# Altium schematic sheet Switch.SchDoc
size A0
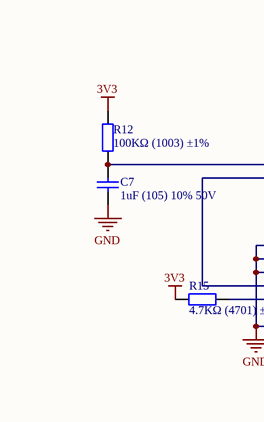
[diagram p0: Switch.SchDoc, top left]
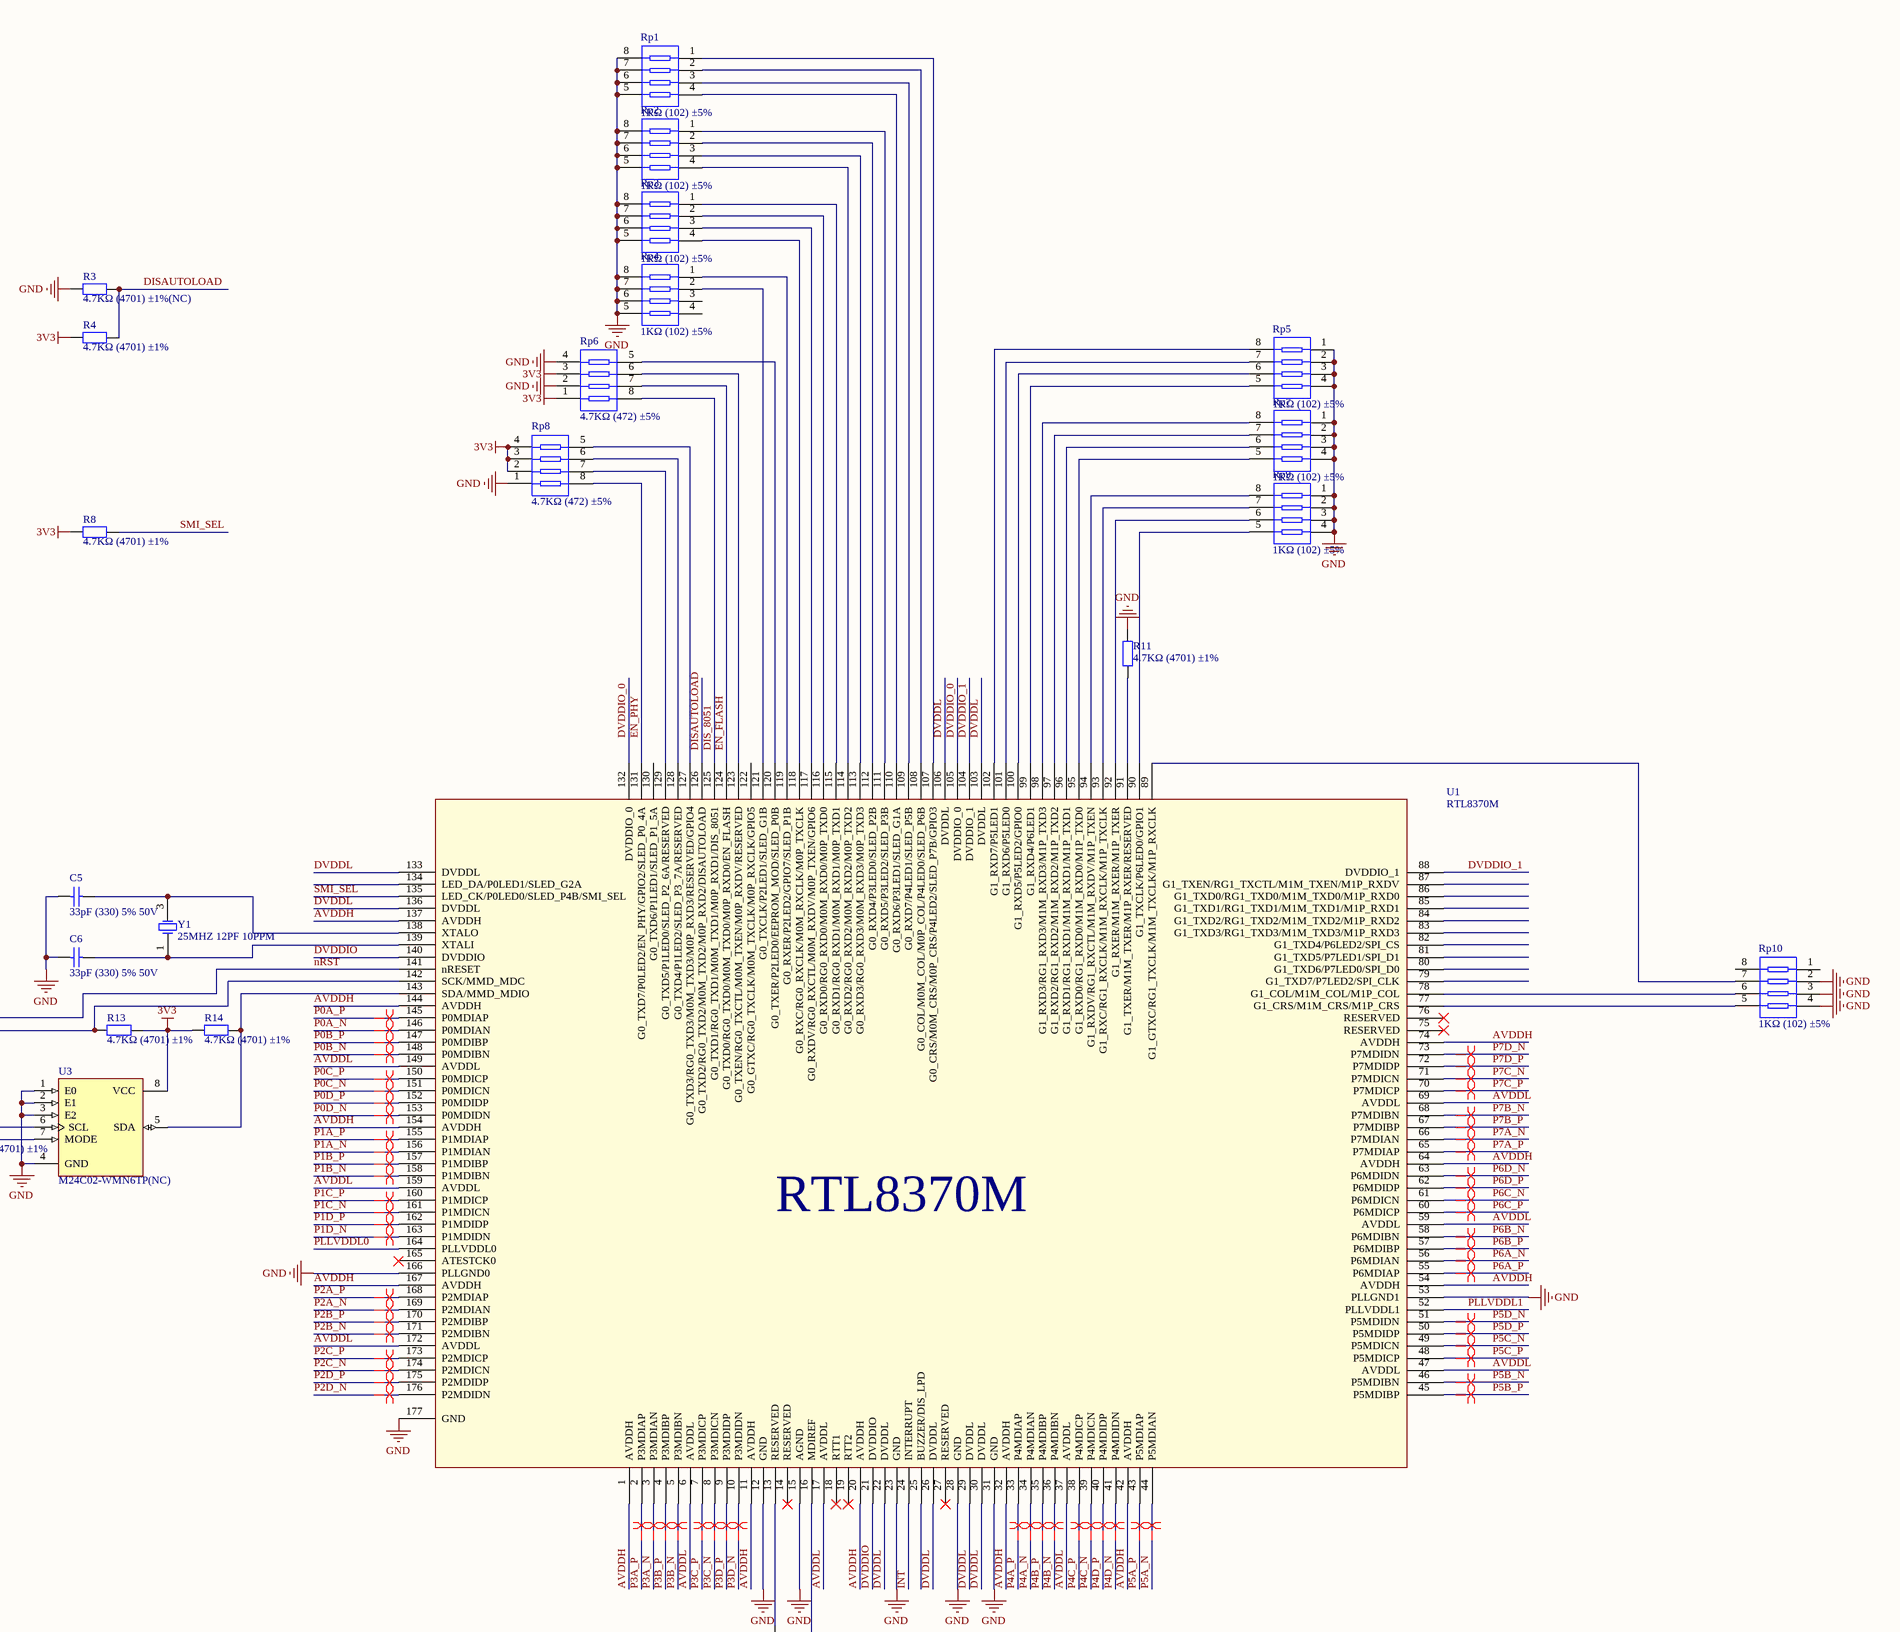
[diagram p1: Switch.SchDoc, top right]
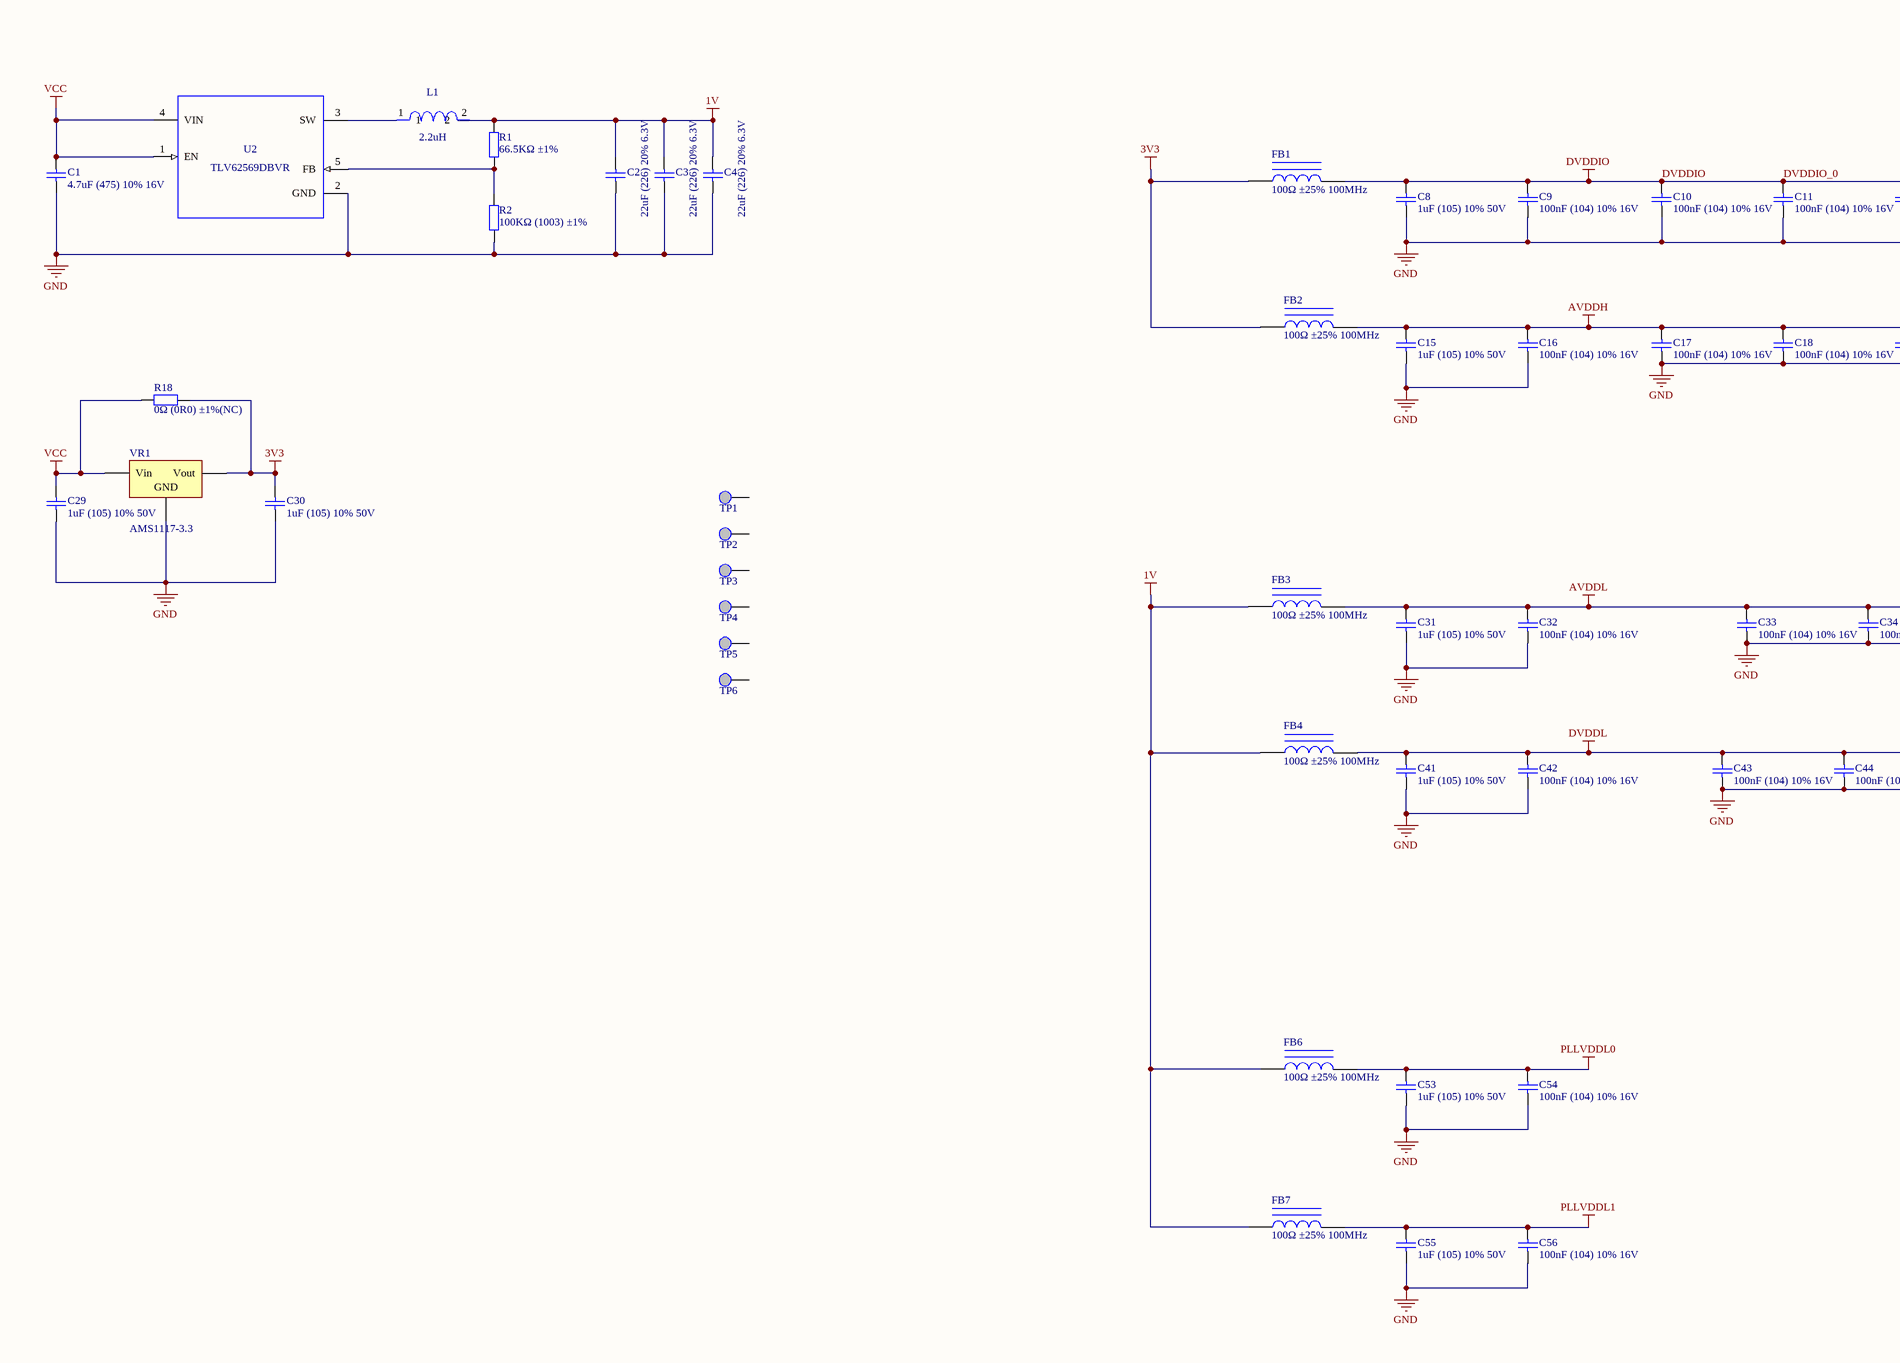
[diagram p2: Switch.SchDoc, bottom left]
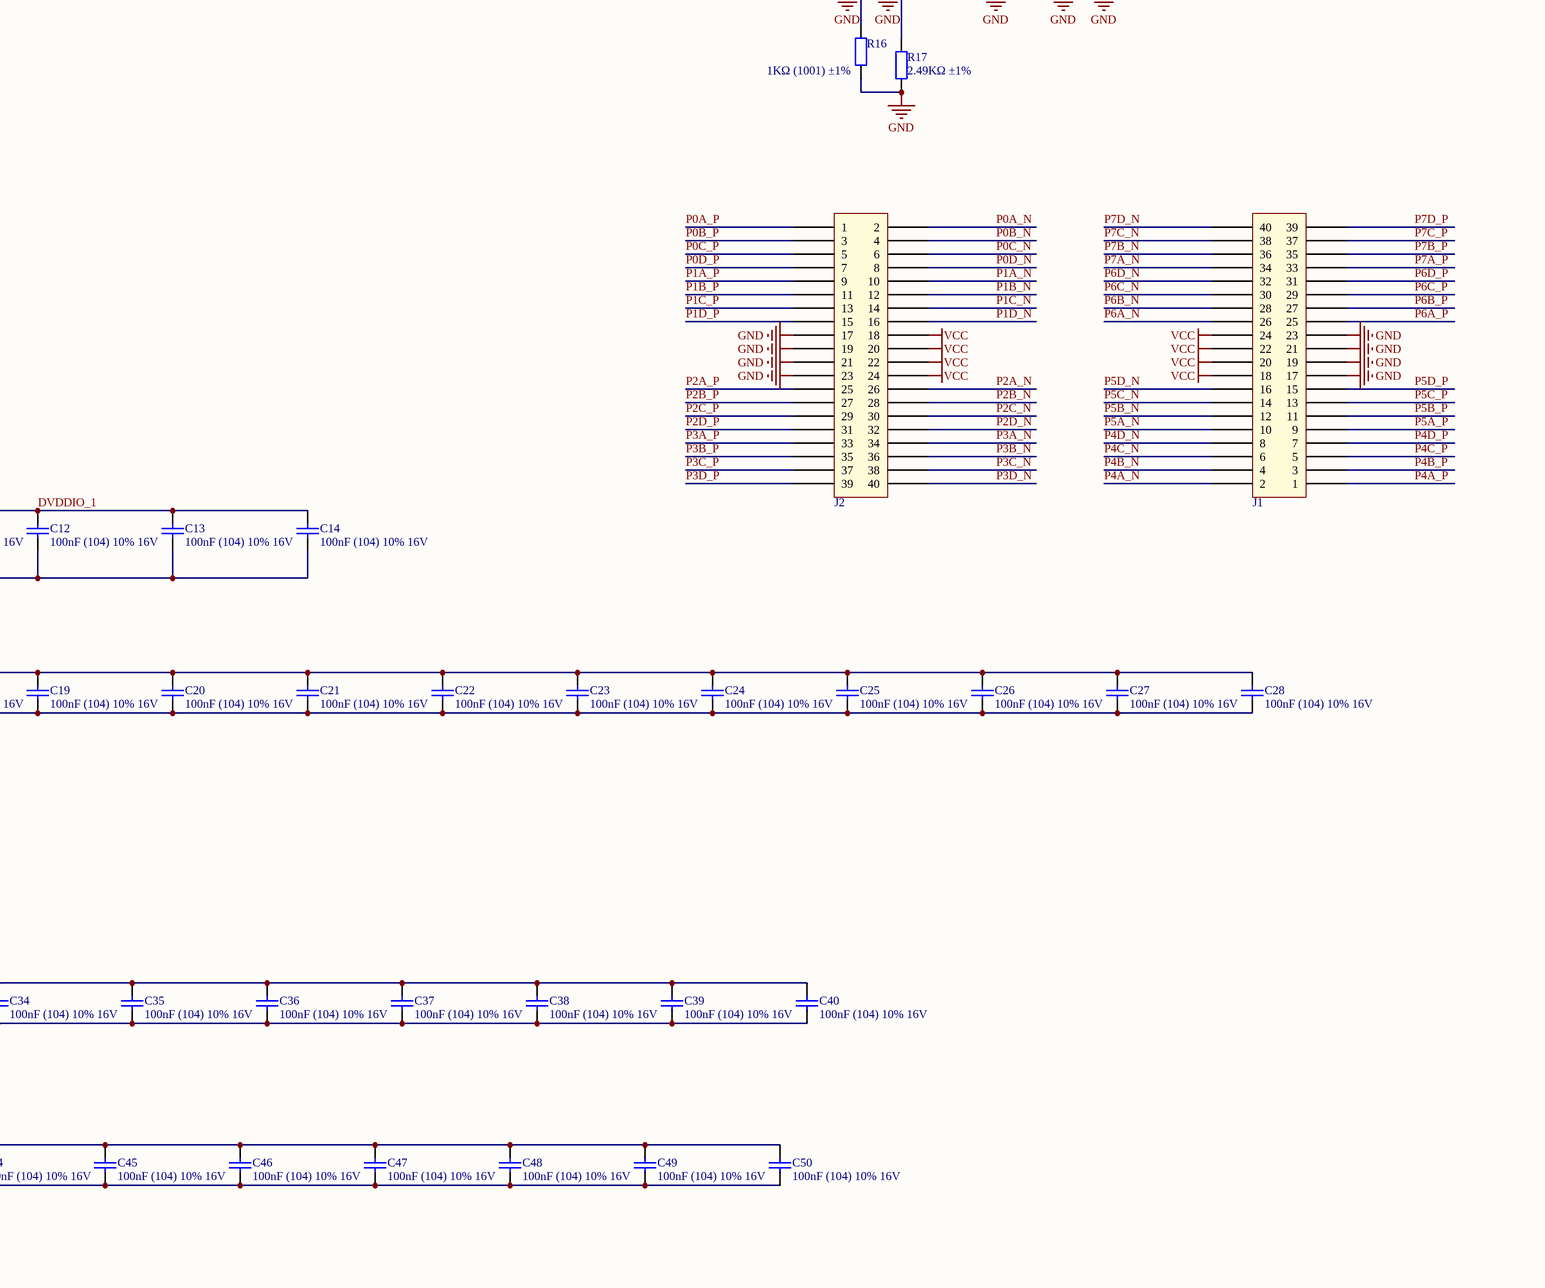
[diagram p3: Switch.SchDoc, bottom right]

## Parts
C1  4.7uF (475) 10% 16V  [0603_C]
C2  22uF (226) 20% 6.3V  [0603_C]
C3  22uF (226) 20% 6.3V  [0603_C]
C4  22uF (226) 20% 6.3V  [0603_C]
C5  33pF (330) 5% 50V  [0402_C]
C6  33pF (330) 5% 50V  [0402_C]
C7  1uF (105) 10% 50V  [0603_C]
C8  1uF (105) 10% 50V  [0603_C]
C9  100nF (104) 10% 16V  [0402_C]
C10  100nF (104) 10% 16V  [0402_C]
C11  100nF (104) 10% 16V  [0402_C]
C12  100nF (104) 10% 16V  [0402_C]
C13  100nF (104) 10% 16V  [0402_C]
C14  100nF (104) 10% 16V  [0402_C]
C15  1uF (105) 10% 50V  [0603_C]
C16  100nF (104) 10% 16V  [0402_C]
C17  100nF (104) 10% 16V  [0402_C]
C18  100nF (104) 10% 16V  [0402_C]
C19  100nF (104) 10% 16V  [0402_C]
C20  100nF (104) 10% 16V  [0402_C]
C21  100nF (104) 10% 16V  [0402_C]
C22  100nF (104) 10% 16V  [0402_C]
C23  100nF (104) 10% 16V  [0402_C]
C24  100nF (104) 10% 16V  [0402_C]
C25  100nF (104) 10% 16V  [0402_C]
C26  100nF (104) 10% 16V  [0402_C]
C27  100nF (104) 10% 16V  [0402_C]
C28  100nF (104) 10% 16V  [0402_C]
C29  1uF (105) 10% 50V  [0603_C]
C30  1uF (105) 10% 50V  [0603_C]
C31  1uF (105) 10% 50V  [0603_C]
C32  100nF (104) 10% 16V  [0402_C]
C33  100nF (104) 10% 16V  [0402_C]
C34  100nF (104) 10% 16V  [0402_C]
C35  100nF (104) 10% 16V  [0402_C]
C36  100nF (104) 10% 16V  [0402_C]
C37  100nF (104) 10% 16V  [0402_C]
C38  100nF (104) 10% 16V  [0402_C]
C39  100nF (104) 10% 16V  [0402_C]
C40  100nF (104) 10% 16V  [0402_C]
C41  1uF (105) 10% 50V  [0603_C]
C42  100nF (104) 10% 16V  [0402_C]
C43  100nF (104) 10% 16V  [0402_C]
C44  100nF (104) 10% 16V  [0402_C]
C45  100nF (104) 10% 16V  [0402_C]
C46  100nF (104) 10% 16V  [0402_C]
C47  100nF (104) 10% 16V  [0402_C]
C48  100nF (104) 10% 16V  [0402_C]
C49  100nF (104) 10% 16V  [0402_C]
C50  100nF (104) 10% 16V  [0402_C]
C53  1uF (105) 10% 50V  [0603_C]
C54  100nF (104) 10% 16V  [0402_C]
C55  1uF (105) 10% 50V  [0603_C]
C56  100nF (104) 10% 16V  [0402_C]
FB1  100Ω ±25% 100MHz  [0805_L]
FB2  100Ω ±25% 100MHz  [0805_L]
FB3  100Ω ±25% 100MHz  [0805_L]
FB4  100Ω ±25% 100MHz  [0805_L]
FB6  100Ω ±25% 100MHz  [0805_L]
FB7  100Ω ±25% 100MHz  [0805_L]
J1  Header20x2_2.54_female  [2-534206-0]  (value not drawn)
J2  Header20x2_2.54_female  [2-534206-0]  (value not drawn)
L1  value 2.2uH  [XAL4020]  (hidden comment: XAL4020-222MEB)
R1  66.5KΩ ±1%  [0603_R]
R2  100KΩ (1003) ±1%  [0603_R]
R3  4.7KΩ (4701) ±1%(NC)  [0402_R]
R4  4.7KΩ (4701) ±1%  [0402_R]
R8  4.7KΩ (4701) ±1%  [0402_R]
R11  4.7KΩ (4701) ±1%  [0402_R]
R12  100KΩ (1003) ±1%  [0402_R]
R13  4.7KΩ (4701) ±1%  [0402_R]
R14  4.7KΩ (4701) ±1%  [0402_R]
R15  4.7KΩ (4701) ±1%  [0402_R]
R16  1KΩ (1001) ±1%  [0402_R]
R17  2.49KΩ ±1%  [0402_R]
R18  0Ω (0R0) ±1%(NC)  [1206_R]
Rp1  1KΩ (102) ±5%  [0402_Rx4]
Rp2  1KΩ (102) ±5%  [0402_Rx4]
Rp3  1KΩ (102) ±5%  [0402_Rx4]
Rp4  1KΩ (102) ±5%  [0402_Rx4]
Rp5  1KΩ (102) ±5%  [0402_Rx4]
Rp6  4.7KΩ (472) ±5%  [0603_Rx4]
Rp7  1KΩ (102) ±5%  [0402_Rx4]
Rp8  4.7KΩ (472) ±5%  [0603_Rx4]
Rp9  1KΩ (102) ±5%  [0402_Rx4]
Rp10  1KΩ (102) ±5%  [0402_Rx4]
TP1  Test Point, 30mil  [test_point_30_mil]  (value not drawn)
TP2  Test Point, 30mil  [test_point_30_mil]  (value not drawn)
TP3  Test Point, 30mil  [test_point_30_mil]  (value not drawn)
TP4  Test Point, 30mil  [test_point_30_mil]  (value not drawn)
TP5  Test Point, 30mil  [test_point_30_mil]  (value not drawn)
TP6  Test Point, 30mil  [test_point_30_mil]  (value not drawn)
U1  RTL8370M  [PLQP0176LA-B-M]
U2  TLV62569DBVR  [DBV0005A_M]
U3  M24C02-WMN6TP(NC)  [SOIC-8_150mil]
VR1  AMS1117-3.3  [SOT-223]
Y1  25MHZ 12PF 10PPM  [SMD-3225_4P]

## Nets
1V: C2.2 C3.2 C4.2 FB3.1 FB4.1 FB6.1 FB7.1 L1.2 R1.2
3V3: C30.2 FB1.1 FB2.1 R4.1 R8.1 R12.2 R13.2 R14.1 R15.1 R18.2 Rp6.1 Rp6.3 Rp8.2 Rp8.3 Rp8.4 U3.8(VCC) VR1.2(Vout)
AVDDH: C15.2 C16.2 C17.2 C18.2 C19.2 C20.2 C21.2 C22.2 C23.2 C24.2 C25.2 C26.2 C27.2 C28.2 FB2.2 U1.1(AVDDH) U1.11(AVDDH) U1.20(AVDDH) U1.32(AVDDH) U1.42(AVDDH) U1.54(AVDDH) U1.64(AVDDH) U1.74(AVDDH) U1.137(AVDDH) U1.144(AVDDH) U1.154(AVDDH) U1.167(AVDDH)
AVDDL: C31.2 C32.2 C33.2 C34.2 C35.2 C36.2 C37.2 C38.2 C39.2 C40.2 FB3.2 U1.6(AVDDL) U1.17(AVDDL) U1.37(AVDDL) U1.47(AVDDL) U1.59(AVDDL) U1.69(AVDDL) U1.149(AVDDL) U1.159(AVDDL) U1.172(AVDDL)
DVDDIO: C8.2 C9.2 C10.2 C11.2 C12.2 C13.2 C14.2 FB1.2 U1.21(DVDDIO) U1.88(DVDDIO_1) U1.104(DVDDIO_1) U1.105(DVDDIO_0) U1.132(DVDDIO_0) U1.140(DVDDIO)  [also labelled DVDDIO_0, DVDDIO_1]
DVDDL: C41.2 C42.2 C43.2 C44.2 C45.2 C46.2 C47.2 C48.2 C49.2 C50.2 FB4.2 U1.22(DVDDL) U1.26(DVDDL) U1.29(DVDDL) U1.30(DVDDL) U1.103(DVDDL) U1.106(DVDDL) U1.133(DVDDL) U1.136(DVDDL)
GND: C1.1 C2.1 C3.1 C4.1 C5.1 C6.1 C7.1 C8.1 C9.1 C10.1 C11.1 C12.1 C13.1 C14.1 C15.1 C16.1 C17.1 C18.1 C19.1 C20.1 C21.1 C22.1 C23.1 C24.1 C25.1 C26.1 C27.1 C28.1 C29.1 C30.1 C31.1 C32.1 C33.1 C34.1 C35.1 C36.1 C37.1 C38.1 C39.1 C40.1 C41.1 C42.1 C43.1 C44.1 C45.1 C46.1 C47.1 C48.1 C49.1 C50.1 C53.1 C54.1 C55.1 C56.1 J1.17 J1.19 J1.21 J1.23 J2.17 J2.19 J2.21 J2.23 R2.1 R3.1 R11.1 R16.1 R17.1 Rp1.5 Rp1.6 Rp1.7 Rp1.8 Rp2.5 Rp2.6 Rp2.7 Rp2.8 Rp3.5 Rp3.6 Rp3.7 Rp3.8 Rp4.5 Rp4.6 Rp4.7 Rp4.8 Rp5.1 Rp5.2 Rp5.3 Rp5.4 Rp6.2 Rp6.4 Rp7.1 Rp7.2 Rp7.3 Rp7.4 Rp8.1 Rp9.1 Rp9.2 Rp9.3 Rp9.4 Rp10.2 Rp10.3 Rp10.4 U1.12(GND) U1.15(AGND) U1.23(GND) U1.28(GND) U1.31(GND) U1.53(PLLGND1) U1.166(PLLGND0) U1.177(GND) U2.2(GND) U3.1(E0) U3.2(E1) U3.3(E2) U3.4(GND) VR1.1(GND)
PLLVDDL0: C53.2 C54.2 FB6.2 U1.164(PLLVDDL0)
PLLVDDL1: C55.2 C56.2 FB7.2 U1.52(PLLVDDL1)
VCC: C1.2 C29.2 J1.18 J1.20 J1.22 J1.24 J2.18 J2.20 J2.22 J2.24 R18.1 U2.1(EN) U2.4(VIN) VR1.3(Vin)
DIS_8051: Rp6.8 U1.125(G0_TXD1/RG0_TXD1/M0M_TXD1/M0P_RXD1/DIS_8051)
DISAUTOLOAD: R3.2 R4.2 U1.126(G0_TXD2/RG0_TXD2/M0M_TXD2/M0P_RXD2/DISAUTOLOAD)
EN_FLASH: Rp6.7 U1.124(G0_TXD0/RG0_TXD0/M0M_TXD0/M0P_RXD0/EN_FLASH)
EN_PHY: Rp8.8 U1.131(G0_TXD7/P0LED2/EN_PHY/GPIO2/SLED_P0_4A)
INT: U1.24(INTERRUPT)
nRST: C7.2 R12.1 U1.141(nRESET)
P0A_N: J2.2 U1.146(P0MDIAN)
P0A_P: J2.1 U1.145(P0MDIAP)
P0B_N: J2.4 U1.148(P0MDIBN)
P0B_P: J2.3 U1.147(P0MDIBP)
P0C_N: J2.6 U1.151(P0MDICN)
P0C_P: J2.5 U1.150(P0MDICP)
P0D_N: J2.8 U1.153(P0MDIDN)
P0D_P: J2.7 U1.152(P0MDIDP)
P1A_N: J2.10 U1.156(P1MDIAN)
P1A_P: J2.9 U1.155(P1MDIAP)
P1B_N: J2.12 U1.158(P1MDIBN)
P1B_P: J2.11 U1.157(P1MDIBP)
P1C_N: J2.14 U1.161(P1MDICN)
P1C_P: J2.13 U1.160(P1MDICP)
P1D_N: J2.16 U1.163(P1MDIDN)
P1D_P: J2.15 U1.162(P1MDIDP)
P2A_N: J2.26 U1.169(P2MDIAN)
P2A_P: J2.25 U1.168(P2MDIAP)
P2B_N: J2.28 U1.171(P2MDIBN)
P2B_P: J2.27 U1.170(P2MDIBP)
P2C_N: J2.30 U1.174(P2MDICN)
P2C_P: J2.29 U1.173(P2MDICP)
P2D_N: J2.32 U1.176(P2MDIDN)
P2D_P: J2.31 U1.175(P2MDIDP)
P3A_N: J2.34 U1.3(P3MDIAN)
P3A_P: J2.33 U1.2(P3MDIAP)
P3B_N: J2.36 U1.5(P3MDIBN)
P3B_P: J2.35 U1.4(P3MDIBP)
P3C_N: J2.38 U1.8(P3MDICN)
P3C_P: J2.37 U1.7(P3MDICP)
P3D_N: J2.40 U1.10(P3MDIDN)
P3D_P: J2.39 U1.9(P3MDIDP)
P4A_N: J1.2 U1.34(P4MDIAN)
P4A_P: J1.1 U1.33(P4MDIAP)
P4B_N: J1.4 U1.36(P4MDIBN)
P4B_P: J1.3 U1.35(P4MDIBP)
P4C_N: J1.6 U1.39(P4MDICN)
P4C_P: J1.5 U1.38(P4MDICP)
P4D_N: J1.8 U1.41(P4MDIDN)
P4D_P: J1.7 U1.40(P4MDIDP)
P5A_N: J1.10 U1.44(P5MDIAN)
P5A_P: J1.9 U1.43(P5MDIAP)
P5B_N: J1.12 U1.46(P5MDIBN)
P5B_P: J1.11 U1.45(P5MDIBP)
P5C_N: J1.14 U1.49(P5MDICN)
P5C_P: J1.13 U1.48(P5MDICP)
P5D_N: J1.16 U1.51(P5MDIDN)
P5D_P: J1.15 U1.50(P5MDIDP)
P6A_N: J1.26 U1.56(P6MDIAN)
P6A_P: J1.25 U1.55(P6MDIAP)
P6B_N: J1.28 U1.58(P6MDIBN)
P6B_P: J1.27 U1.57(P6MDIBP)
P6C_N: J1.30 U1.61(P6MDICN)
P6C_P: J1.29 U1.60(P6MDICP)
P6D_N: J1.32 U1.63(P6MDIDN)
P6D_P: J1.31 U1.62(P6MDIDP)
P7A_N: J1.34 U1.66(P7MDIAN)
P7A_P: J1.33 U1.65(P7MDIAP)
P7B_N: J1.36 U1.68(P7MDIBN)
P7B_P: J1.35 U1.67(P7MDIBP)
P7C_N: J1.38 U1.71(P7MDICN)
P7C_P: J1.37 U1.70(P7MDICP)
P7D_N: J1.40 U1.73(P7MDIDN)
P7D_P: J1.39 U1.72(P7MDIDP)
SMI_SEL: R8.2 U1.135(LED_CK/P0LED0/SLED_P4B/SMI_SEL)
NetC5_2: C5.2 U1.138(XTALO) Y1.3(OSC2)
NetC6_2: C6.2 U1.139(XTALI) Y1.1(OSC1)
NetL1_1: L1.1 U2.3(SW)
NetR1_1: R1.1 R2.2 U2.5(FB)
NetR11_2: R11.2 U1.91(G1_TXER/M1M_TXER/M1P_RXER/RESERVED)
NetR13_1: R13.1 U1.142(SCK/MMD_MDC) U3.6(SCL)
NetR14_2: R14.2 U1.143(SDA/MMD_MDIO) U3.5(SDA)
NetR15_2: R15.2 U3.7(MODE)
NetR16_2: R16.2 U1.13(RESERVED)
NetR17_2: R17.2 U1.16(MDIREF)
NetRp1_1: Rp1.1 U1.107(G0_CRS/M0M_CRS/M0P_CRS/P4LED2/SLED_P7B/GPIO3)
NetRp1_2: Rp1.2 U1.108(G0_COL/M0M_COL/M0P_COL/P4LED0/SLED_P6B)
NetRp1_3: Rp1.3 U1.109(G0_RXD7/P4LED1/SLED_P5B)
NetRp1_4: Rp1.4 U1.110(G0_RXD6/P3LED1/SLED_G1A)
NetRp2_1: Rp2.1 U1.111(G0_RXD5/P3LED2/SLED_P3B)
NetRp2_2: Rp2.2 U1.112(G0_RXD4/P3LED0/SLED_P2B)
NetRp2_3: Rp2.3 U1.113(G0_RXD3/RG0_RXD3/M0M_RXD3/M0P_TXD3)
NetRp2_4: Rp2.4 U1.114(G0_RXD2/RG0_RXD2/M0M_RXD2/M0P_TXD2)
NetRp3_1: Rp3.1 U1.115(G0_RXD1/RG0_RXD1/M0M_RXD1/M0P_TXD1)
NetRp3_2: Rp3.2 U1.116(G0_RXD0/RG0_RXD0/M0M_RXD0/M0P_TXD0)
NetRp3_3: Rp3.3 U1.117(G0_RXDV/RG0_RXCTL/M0M_RXDV/M0P_TXEN/GPIO6)
NetRp3_4: Rp3.4 U1.118(G0_RXC/RG0_RXCLK/M0M_RXCLK/M0P_TXCLK)
NetRp4_1: Rp4.1 U1.119(G0_RXER/P2LED2/GPIO7/SLED_P1B)
NetRp4_2: Rp4.2 U1.121(G0_TXCLK/P2LED1/SLED_G1B)
NetRp5_5: Rp5.5 U1.99(G1_RXD4/P6LED1)
NetRp5_6: Rp5.6 U1.100(G1_RXD5/P5LED2/GPIO0)
NetRp5_7: Rp5.7 U1.101(G1_RXD6/P5LED0)
NetRp5_8: Rp5.8 U1.102(G1_RXD7/P5LED1)
NetRp6_5: Rp6.5 U1.120(G0_TXER/P2LED0/EEPROM_MOD/SLED_P0B)
NetRp6_6: Rp6.6 U1.123(G0_TXEN/RG0_TXCTL/M0M_TXEN/M0P_RXDV/RESERVED)
NetRp7_5: Rp7.5 U1.95(G1_RXD0/RG1_RXD0/M1M_RXD0/M1P_TXD0)
NetRp7_6: Rp7.6 U1.96(G1_RXD1/RG1_RXD1/M1M_RXD1/M1P_TXD1)
NetRp7_7: Rp7.7 U1.97(G1_RXD2/RG1_RXD2/M1M_RXD2/M1P_TXD2)
NetRp7_8: Rp7.8 U1.98(G1_RXD3/RG1_RXD3/M1M_RXD3/M1P_TXD3)
NetRp8_5: Rp8.5 U1.127(G0_TXD3/RG0_TXD3/M0M_TXD3/M0P_RXD3/RESERVED/GPIO4)
NetRp8_6: Rp8.6 U1.128(G0_TXD4/P1LED2/SLED_P3_7A/RESERVED)
NetRp8_7: Rp8.7 U1.129(G0_TXD5/P1LED0/SLED_P2_6A/RESERVED)
NetRp9_5: Rp9.5 U1.90(G1_TXCLK/P6LED0/GPIO1)
NetRp9_6: Rp9.6 U1.92(G1_RXER/M1M_RXER/M1P_TXER)
NetRp9_7: Rp9.7 U1.93(G1_RXC/RG1_RXCLK/M1M_RXCLK/M1P_TXCLK)
NetRp9_8: Rp9.8 U1.94(G1_RXDV/RG1_RXCTL/M1M_RXDV/M1P_TXEN)
NetRp10_5: Rp10.5 U1.77(G1_CRS/M1M_CRS/M1P_CRS)
NetRp10_6: Rp10.6 U1.78(G1_COL/M1M_COL/M1P_COL)
NetRp10_7: Rp10.7 U1.89(G1_GTXC/RG1_TXCLK/M1M_TXCLK/M1P_RXCLK)

Not connected (* = marked no-connect by the designer): Rp4 3 4; Rp10 1 8; TP1 0; TP2 0; TP3 0; TP4 0; TP5 0; TP6 0; U1 14(RESERVED)* 18(RTT1)* 19(RTT2)* 25(BUZZER/DIS_LPD) 27(RESERVED)* 75(RESERVED)* 76(RESERVED)* 79(G1_TXD7/P7LED2/SPI_CLK) 80(G1_TXD6/P7LED0/SPI_D0) 81(G1_TXD5/P7LED1/SPI_D1) 82(G1_TXD4/P6LED2/SPI_CS) 83(G1_TXD3/RG1_TXD3/M1M_TXD3/M1P_RXD3) 84(G1_TXD2/RG1_TXD2/M1M_TXD2/M1P_RXD2) 85(G1_TXD1/RG1_TXD1/M1M_TXD1/M1P_RXD1) 86(G1_TXD0/RG1_TXD0/M1M_TXD0/M1P_RXD0) 87(G1_TXEN/RG1_TXCTL/M1M_TXEN/M1P_RXDV) 122(G0_GTXC/RG0_TXCLK/M0M_TXCLK/M0P_RXCLK/GPIO5) 130(G0_TXD6/P1LED1/SLED_P1_5A) 134(LED_DA/P0LED1/SLED_G2A) 165(ATESTCK0)*

## Layout directives
differential pair: P0A_N, P0A_P, P0B_N, P0B_P, P0C_N, P0C_P, P0D_N, P0D_P, P1A_N, P1A_P, P1B_N, P1B_P, P1C_N, P1C_P, P1D_N, P1D_P, P2A_N, P2A_P, P2B_N, P2B_P, P2C_N, P2C_P, P2D_N, P2D_P, P3A_N, P3A_P, P3B_N, P3B_P, P3C_N, P3C_P, P3D_N, P3D_P, P4A_N, P4A_P, P4B_N, P4B_P, P4C_N, P4C_P, P4D_N, P4D_P, P5A_N, P5A_P, P5B_N, P5B_P, P5C_N, P5C_P, P5D_N, P5D_P, P6A_N, P6A_P, P6B_N, P6B_P, P6C_N, P6C_P, P6D_N, P6D_P, P7A_N, P7A_P, P7B_N, P7B_P, P7C_N, P7C_P, P7D_N, P7D_P

## Library data of the parts
C1 = 0603 4.7uF (475) 10% 16V: 贴片电容; ComponentLink1Description: 供应商链接; ComponentLink1URL: http://www.szlcsc.com/product/details_20375.html; Package: 0603; Supplier: LC; SuppliersPartNumber: C19666
C2-C4 = 0603 22uF (226) 20% 6.3V: 贴片电容; ComponentLink1Description: 供应商链接; ComponentLink1URL: http://www.szlcsc.com/product/details_60514.html; Package: 0603; Supplier: LC; SuppliersPartNumber: C59461
C5 C6 = 0402 33pF (330) 5% 50V: 贴片电容; ComponentLink1Description: 供应商链接; ComponentLink1URL: http://www.szlcsc.com/product/details_1914.html; Package: 0402; Supplier: LC; SuppliersPartNumber: C1562
C7 C8 C15 C29-C31 C41 C53 C55 = 0603 1uF (105) 10% 50V: 贴片电容; ComponentLink1Description: 供应商链接; ComponentLink1URL: http://www.szlcsc.com/product/details_16531.html; Package: 0603; Supplier: LC; SuppliersPartNumber: C15849
C9-C14 C16-C28 C32-C40 C42-C50 C54 C56 = 0402 100nF (104) 10% 16V: 贴片电容; ComponentLink1Description: 供应商链接; ComponentLink1URL: http://www.szlcsc.com/product/details_1877.html; Package: 0402; Supplier: LC; SuppliersPartNumber: C1525
FB1-FB4 FB6 FB7 = 0805 100Ω 25% 100MHz: 贴片磁珠; ComponentLink1Description: 供应商链接; ComponentLink1URL: http://www.szlcsc.com/product/details_1367.html; Package: 0805; Supplier: LC; SuppliersPartNumber: C1015
L1 = XAL4020-222MEB: Manufacturer Name: Coilcraft; PackageReference: XAL4020-222MEB; Manufacturer Part Number: XAL4020-222MEB
R1 R2 = 0603 100KΩ (1003) 1%: 贴片电阻; ComponentLink1Description: 供应商链接; Package: 0603; Supplier: LC; SuppliersPartNumber: C25803
  R2: ComponentLink1URL: http://www.szlcsc.com/product/details_26546.html
R3 R4 R8 R11 R13-R15 = 0402 4.7KΩ (4701) 1%: 贴片电阻; ComponentLink1Description: 供应商链接; ComponentLink1URL: http://www.szlcsc.com/product/details_26643.html; Package: 0402; Supplier: LC; SuppliersPartNumber: C25900
R12 = 0402 100KΩ (1003) 1%: 贴片电阻; ComponentLink1Description: 供应商链接; ComponentLink1URL: http://www.szlcsc.com/product/details_26484.html; Package: 0402; Supplier: LC; SuppliersPartNumber: C25741
R16 = 0402 1KΩ (1001) 1%: 贴片电阻; ComponentLink1Description: 供应商链接; ComponentLink1URL: http://www.szlcsc.com/product/details_12256.html; Package: 0402; Supplier: LC; SuppliersPartNumber: C11702
R17 = 0402 2KΩ (2001) 1%: 贴片电阻; ComponentLink1Description: 供应商链接; ComponentLink1URL: http://www.szlcsc.com/product/details_4516.html; Package: 0402; Supplier: LC; SuppliersPartNumber: C4109
R18 = 1206 0Ω (0R0) 1%: 贴片电阻; ComponentLink1Description: 供应商链接; ComponentLink1URL: http://www.szlcsc.com/product/details_18576.html; Package: 1206; Supplier: LC; SuppliersPartNumber: C17888
Rp1-Rp5 Rp7 Rp9 Rp10 = 0402*4 1KΩ (102) 5%: 贴片排阻; ComponentLink1Description: 供应商链接; ComponentLink1URL: http://www.szlcsc.com/product/details_26469.html; Package: 0402*4; Supplier: LC; SuppliersPartNumber: C25726
Rp6 Rp8 = 0603*4  4.7KΩ (472) 5%: 贴片排阻; ComponentLink1Description: 供应商链接; ComponentLink1URL: http://www.szlcsc.com/product/details_2332.html; Package: 0603*4; Supplier: LC; SuppliersPartNumber: C1980
TP1-TP6 = Test Point, 30mil: Designator: TP?; Part Number: Test Point, 30mil; Component Type: Standard (No BOM)
U2 = TLV62569DBVR: Manufacturer Name: Texas Instruments; PackageReference: TLV62569DBVR; Manufacturer Part Number: TLV62569DBVR; Value: N/A
U3 = M24C02-WMN6TP_[C7562]: EEPROM; ComponentLink1Description: 供应商链接; ComponentLink1URL: http://www.szlcsc.com/product/details_8039.html; Package: SOIC-8_150mil; Supplier: LC; SuppliersPartNumber: C7562
VR1 = SOT-223 AMS1117-3.3: 低压差线性稳压(LDO); ComponentLink1Description: 供应商链接; ComponentLink1URL: http://www.szlcsc.com/product/details_6652.html; Package: SOT-223; Supplier: LC; SuppliersPartNumber: C6186
Y1 = SMD-3225_4P  25MHZ 12PF 10PPM: 贴片晶振; ComponentLink1Description: 供应商链接; ComponentLink1URL: http://www.szlcsc.com/product/details_9526.html; Package: SMD-3225_4P; Supplier: LC; SuppliersPartNumber: C9006